# Altium schematic sheet STM32H7_Expand.SchDoc
size A3; SheetNumber: 1; SheetTotal: 1
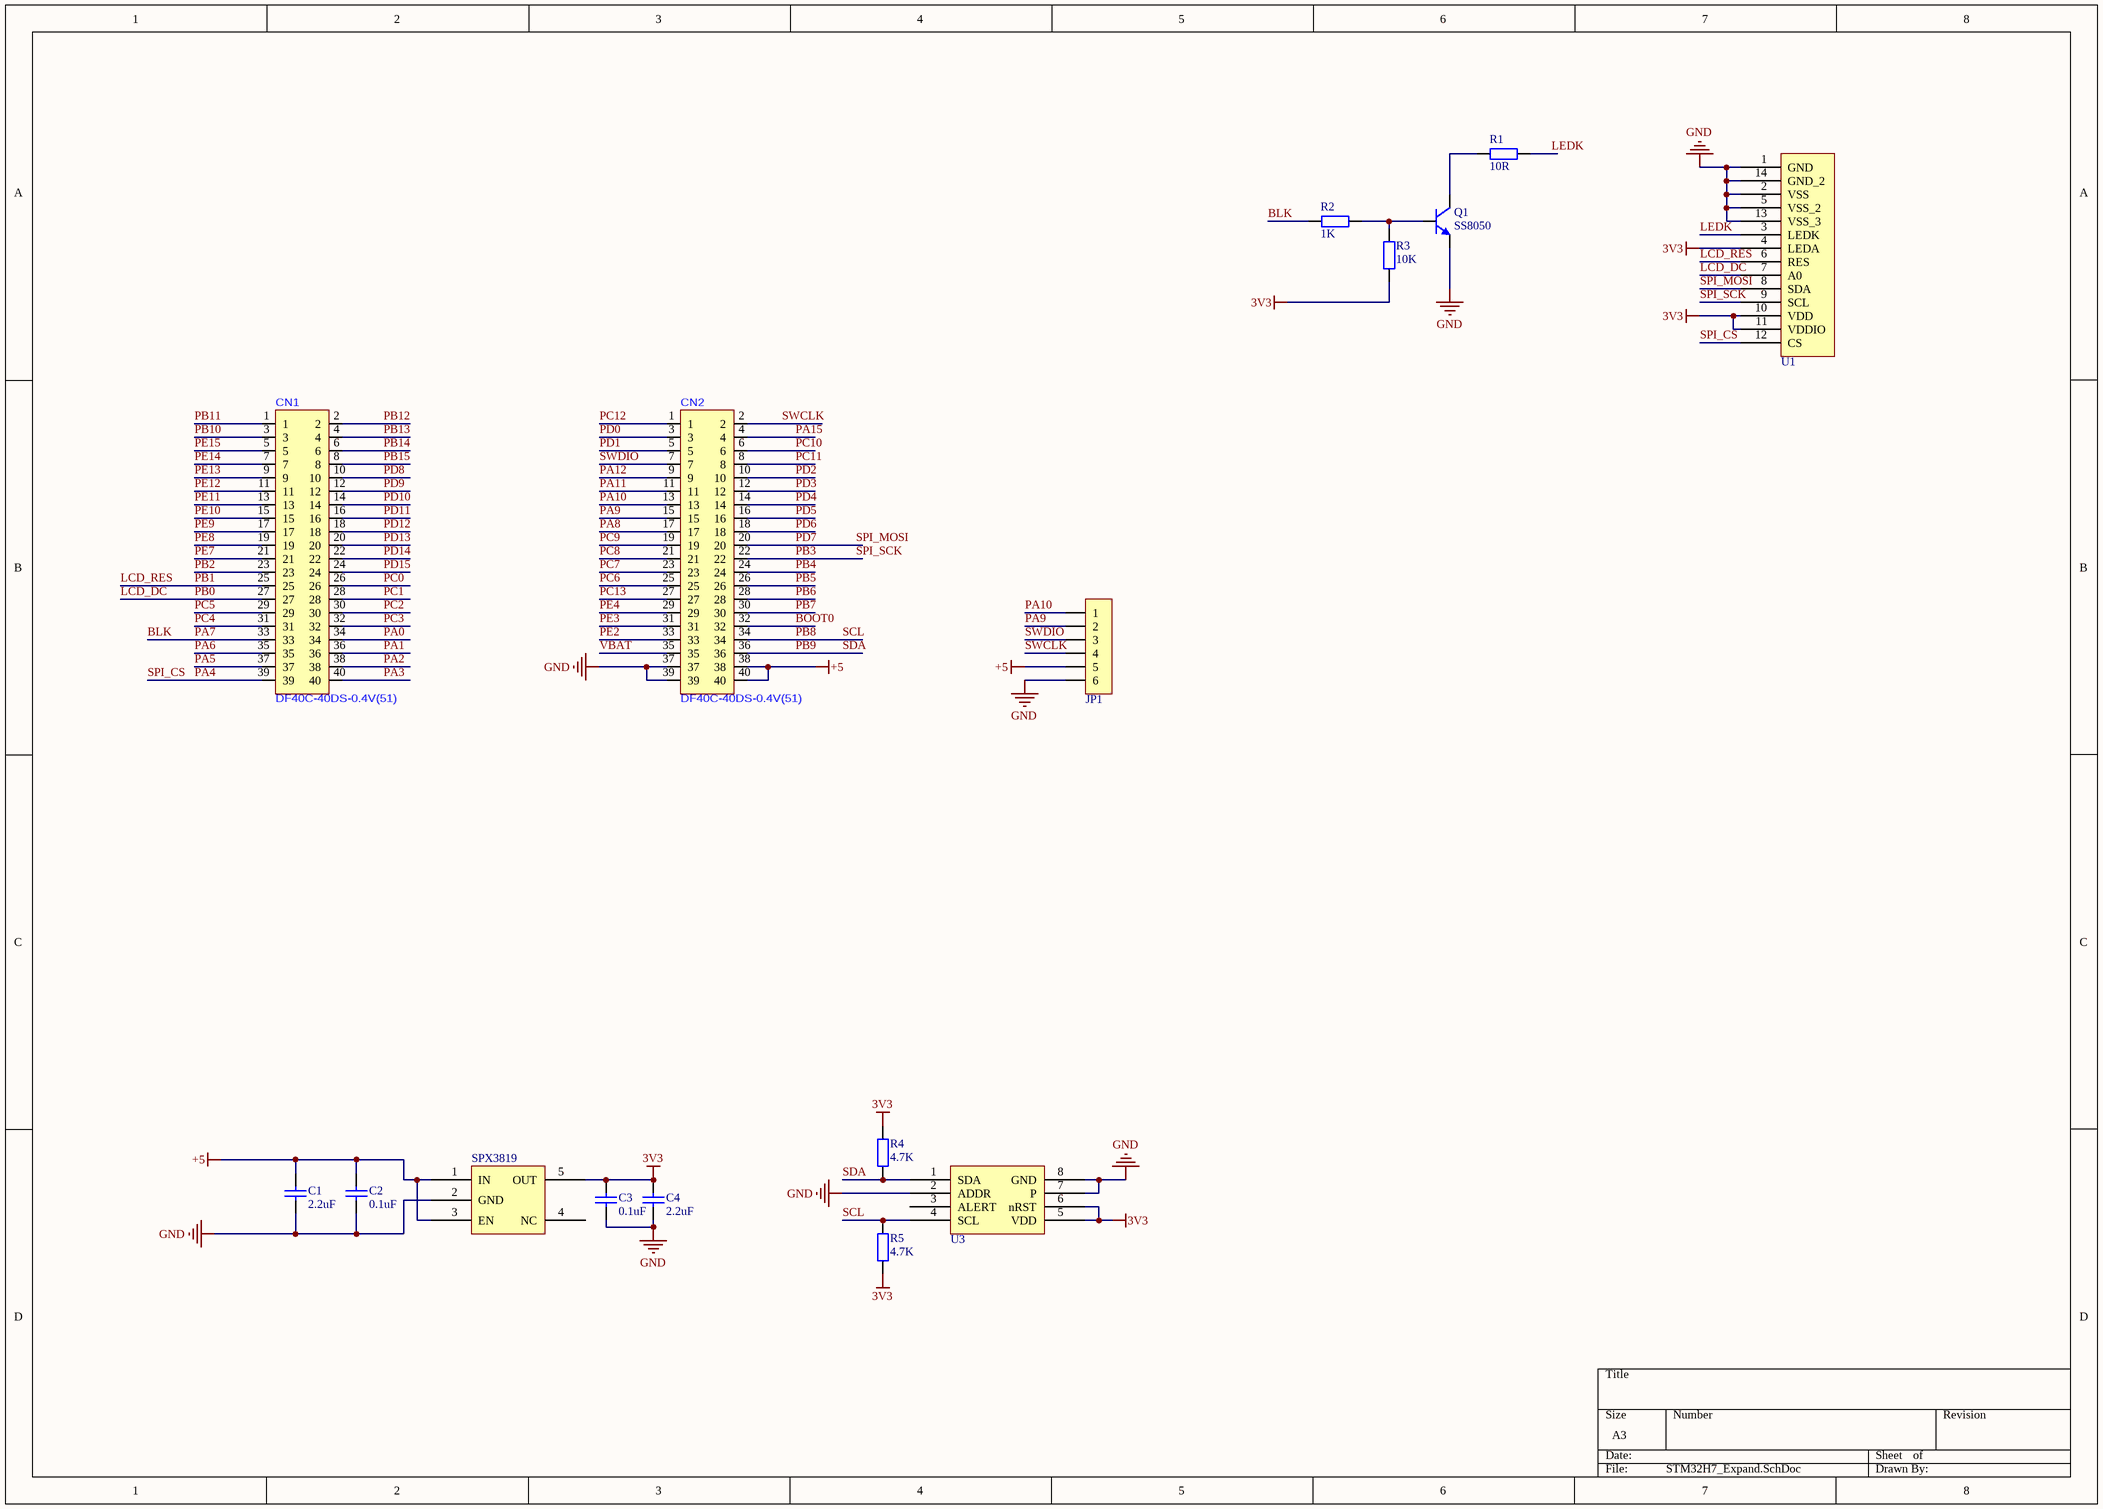
[diagram p0: STM32H7_Expand.SchDoc]

## Parts
C1  2.2uF  [C0603_L]
C2  0.1uF  [C0603_L]
C3  0.1uF  [C0603_L]
C4  2.2uF  [C0603_L]
CN1  DF40C-40DS-0.4V(51)  [DF40C-40DS-0.4V]
CN2  DF40C-40DS-0.4V(51)  [DF40C-40DS-0.4V]
JP1  HDR-1X6  [ZH1.5-WS-6P]  (value not drawn)
Q1  SS8050  [SOT23-3N]
R1  10R  [R0603_L]
R2  1K  [R0603_L]
R3  10K  [R0603_L]
R4  4.7K  [R0603_L]
R5  4.7K  [R0603_L]
U1  SPI144-14  [FPC-0.8-14PIN]  (value not drawn)
U2  SPX3819  [SOT23-5L]
U3  GXTS03  [DFN-8]  (value not drawn)

## Nets
3V3: C3.2 C4.2 R3.1 R4.2 R5.1 U1.4(LEDA) U1.10(VDD) U1.11(VDDIO) U2.5(OUT) U3.5(VDD) U3.6(nRST)
+5: C1.2 C2.2 CN2.38 CN2.40 JP1.5 U2.1(IN) U2.3(EN)
GND: C1.1 C2.1 C3.1 C4.1 CN2.37 CN2.39 JP1.6 Q1.2(E) U1.1(GND) U1.2(VSS) U1.5(VSS_2) U1.13(VSS_3) U1.14(GND_2) U2.2(GND) U3.2(ADDR) U3.7(P) U3.8(GND)
BLK: CN1.33 R2.1  [also labelled PA7]
BOOT0: CN2.32
LCD_DC: CN1.27 U1.7(A0)  [also labelled PB0]
LCD_RES: CN1.25 U1.6(RES)  [also labelled PB1]
LEDK: R1.1 U1.3(LEDK)
PA0: CN1.34
PA1: CN1.36
PA2: CN1.38
PA3: CN1.40
PA4: CN1.39 U1.12(CS)  [also labelled SPI_CS]
PA5: CN1.37
PA6: CN1.35
PA8: CN2.17
PA9: CN2.15 JP1.2
PA10: CN2.13 JP1.1
PA11: CN2.11
PA12: CN2.9
PA15: CN2.4
PB2: CN1.23
PB3: CN2.22 U1.9(SCL)  [also labelled SPI_SCK]
PB4: CN2.24
PB5: CN2.26
PB6: CN2.28
PB7: CN2.30
PB8: CN2.34 R5.2 U3.4(SCL)  [also labelled SCL]
PB9: CN2.36 R4.1 U3.1(SDA)  [also labelled SDA]
PB10: CN1.3
PB11: CN1.1
PB12: CN1.2
PB13: CN1.4
PB14: CN1.6
PB15: CN1.8
PC0: CN1.26
PC1: CN1.28
PC2: CN1.30
PC3: CN1.32
PC4: CN1.31
PC5: CN1.29
PC6: CN2.25
PC7: CN2.23
PC8: CN2.21
PC9: CN2.19
PC10: CN2.6
PC11: CN2.8
PC12: CN2.1
PC13: CN2.27
PD0: CN2.3
PD1: CN2.5
PD2: CN2.10
PD3: CN2.12
PD4: CN2.14
PD5: CN2.16
PD6: CN2.18
PD7: CN2.20 U1.8(SDA)  [also labelled SPI_MOSI]
PD8: CN1.10
PD9: CN1.12
PD10: CN1.14
PD11: CN1.16
PD12: CN1.18
PD13: CN1.20
PD14: CN1.22
PD15: CN1.24
PE2: CN2.33
PE3: CN2.31
PE4: CN2.29
PE7: CN1.21
PE8: CN1.19
PE9: CN1.17
PE10: CN1.15
PE11: CN1.13
PE12: CN1.11
PE13: CN1.9
PE14: CN1.7
PE15: CN1.5
SWCLK: CN2.2 JP1.4
SWDIO: CN2.7 JP1.3
VBAT: CN2.35
NetQ1_1: Q1.1(B) R2.2 R3.2
NetQ1_3: Q1.3(C) R1.2

Not connected (* = marked no-connect by the designer): U2 4(NC); U3 3(ALERT)

## Library data of the parts
C1-C4 = C: 贴片电容; BOM名称: 无极性贴片电容; 联系卖家，免费查找封装: 唯一出售店铺网址https://shop463601444.taobao.com; 封装库来自淘宝卖家ID：黄晶宝石: 其他店铺购入均为盗版假冒封装库，请立即申请退款
CN1 CN2 = DF40C-40DS-0.4V(51): BTB 母座 / C424644
JP1 = Header 6: 6P接插件; 联系卖家，免费查找封装: 唯一出售店铺网址https://shop463601444.taobao.com; BOM名称: 6P接插件
Q1 = 8050-SMD: C2150 / NPN; BOM名称: 高频放大-NPN型; 联系卖家，免费查找封装: 唯一出售店铺网址https://shop463601444.taobao.com; 封装库来自淘宝卖家 ID：黄晶宝石: 其他店铺购入均为盗版，不享受售后技术支持服务，请立即申请退款; 参数: 40V 1.5A 1W 100MHZ
R1-R5 = R: 贴片电阻; 联系卖家，免费查找封装: 唯一出售店铺网址https://shop463601444.taobao.com; 封装库来自淘宝卖家ID：黄晶宝石: 其他店铺购入均为盗版假冒封装库，请立即申请退款; BOM名称: 贴片电阻
U3 = GXTS03: 温度传感器 / C571219